# Altium schematic sheet Integrator.SchDoc
size A4
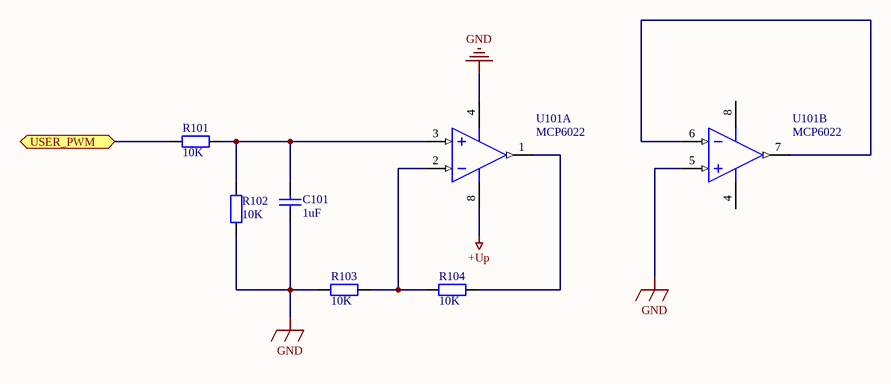
[diagram p0: Integrator.SchDoc]

## Parts
C101  1uF  [0805]
R101  10K  [1206_SMD_Resistor]
R102  10K  [1206_SMD_Resistor]
R103  10K  [1206_SMD_Resistor]
R104  10K  [1206_SMD_Resistor]
U101  MCP6022  [SOIC-SN8_N]  (parts A,B of 2)

## Ports
USER_PWM

## Nets
+Up: U101.8(VDD)
GND: C101.1 R102.1 R103.1 U101.4(VSS) U101.5(VINB+)
USER_PWM: R101.1 ; port USER_PWM
NetC101_2: C101.2 R101.2 R102.2 U101.3(VINA+)
NetR103_2: R103.2 R104.1 U101.2(VINA-)
NetR104_2: R104.2 U101.1(VOUTA)
NetU101_6: U101.6(VINB-) U101.7(VOUTB)

## Library data of the parts
C101 = Capacitor SMD: Capacitor; Published: 8-Jun-2000; LatestRevisionDate: 17-Jul-2002; LatestRevisionNote: Re-released for DXP Platform.; PackageReference: RAD-0.3; Publisher: Altium Limited; Value: 1uF
R101-R104 = Resistor: Published: 31-Aug-2014; Publisher: Dmitry Kuzmin; Value: 10K
U101 = MCP6022-I/SN: Rail-to-Rail Input/Output, 10 MHz Operational Amplifier, 8-Pin SOIC, Industrial Temperature; Published: 29-Jan-2009; LatestRevisionDate: 02-Dec-2009; LatestRevisionNote: Updated to datasheet revision D, Feb-2009; DatasheetVersion: revD, Feb-2009; PackageVersion: revBB, Aug-2009; PackageReference: SOIC-SN8; Publisher: Altium Limited; PackageDescription: 8-Lead Plastic Small Outline (SN) - Narrow, 3.90mm Body [SOIC]; Supplier 1: Digi-Key; Supplier Part Number 1: MCP6022-I/SN-ND; Supplier 2: Farnell; Supplier Part Number 2: 1439415; Code_JEDEC: MS-012; Code_IPC: SOIC127P600-8; ComponentLink1Description: Datasheet; ComponentLink1URL: http://ww1.microchip.com/downloads/en/DeviceDoc/21685d.pdf; ComponentLink2Description: Packaging Specification; ComponentLink2URL: http://www.microchip.com/stellent/groups/techpub_sg/documents/packagingspec/en012702.pdf; ComponentLink3Description: Microchip.com Home; ComponentLink3URL: http://www.microchip.com/